# EAGLE design USB_3V3 (EAGLE 5.06)
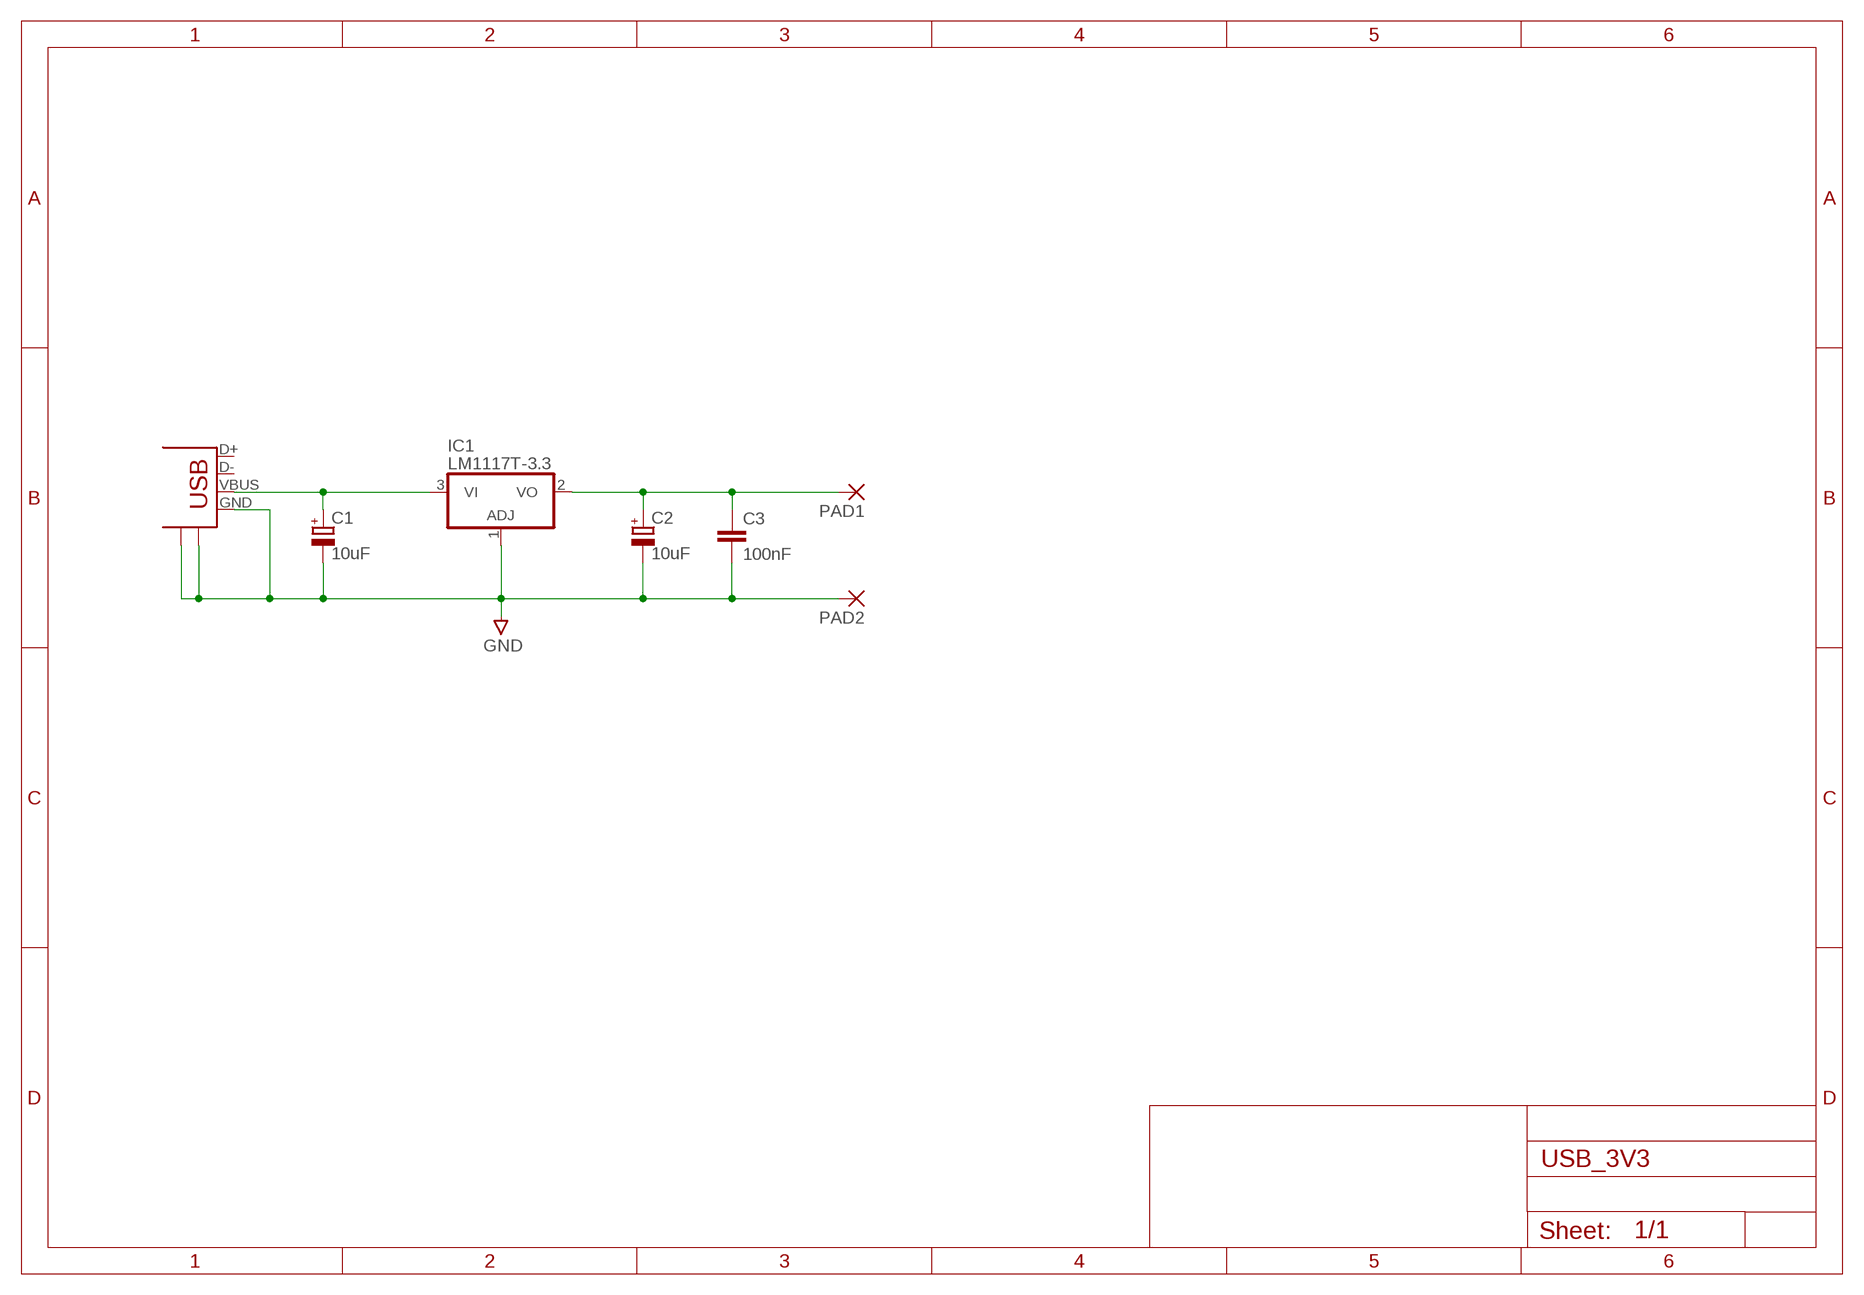
[diagram p0: schematic, sheet 1]

## Parts
C1  10uF  CPOL-EUE2.5-6  [E2,5-6]
C2  10uF  CPOL-EUE2.5-6  [E2,5-6]
C3  100nF  C-EU025-025X050  [C025-025X050]
IC1  LM1117T-3.3  317T  [TO220H]
PAD1  2,15/1,0  [2,15/1,0]
PAD2  2,15/1,0  [2,15/1,0]
USB1  USB-B-H  [USB-B-H]

## Nets
3V3OUT: C2.+ C3.1 IC1.2(VO) PAD1.1(P)
GND: C1.- C2.- C3.2 IC1.1(ADJ) PAD2.1(P) USB1.GND USB1.GND@1(GND) USB1.GND@2(GND)
VBUS: C1.+ IC1.3(VI) USB1.VBUS
Unconnected: USB1.D+ USB1.D-

## Library data of the parts
C1 C2 = rcl:CPOL-EU: POLARIZED CAPACITOR, European symbol
C3 = rcl:C-EU: CAPACITOR, European symbol
IC1 = linear:*317: Positive VOLTAGE REGULATOR
PAD1 PAD2 = wirepad:2,15/1,0: THROUGH-HOLE PAD
USB1 = IANS:USB: USB Connectors

## Board
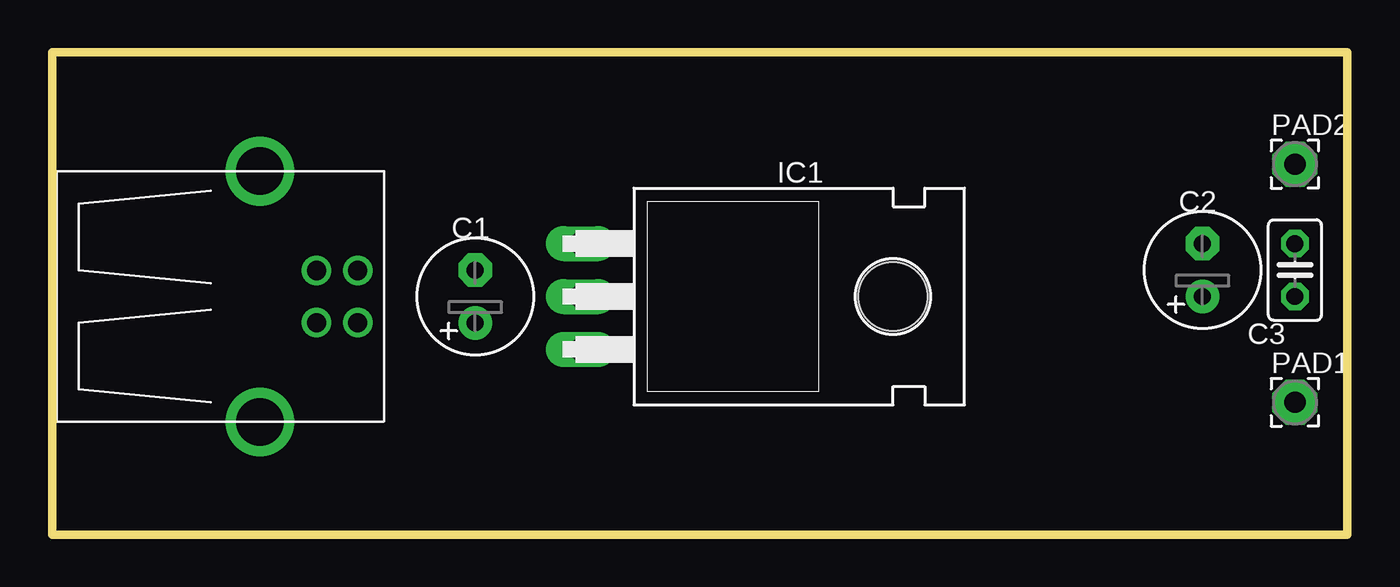
[diagram p1: board, top side]
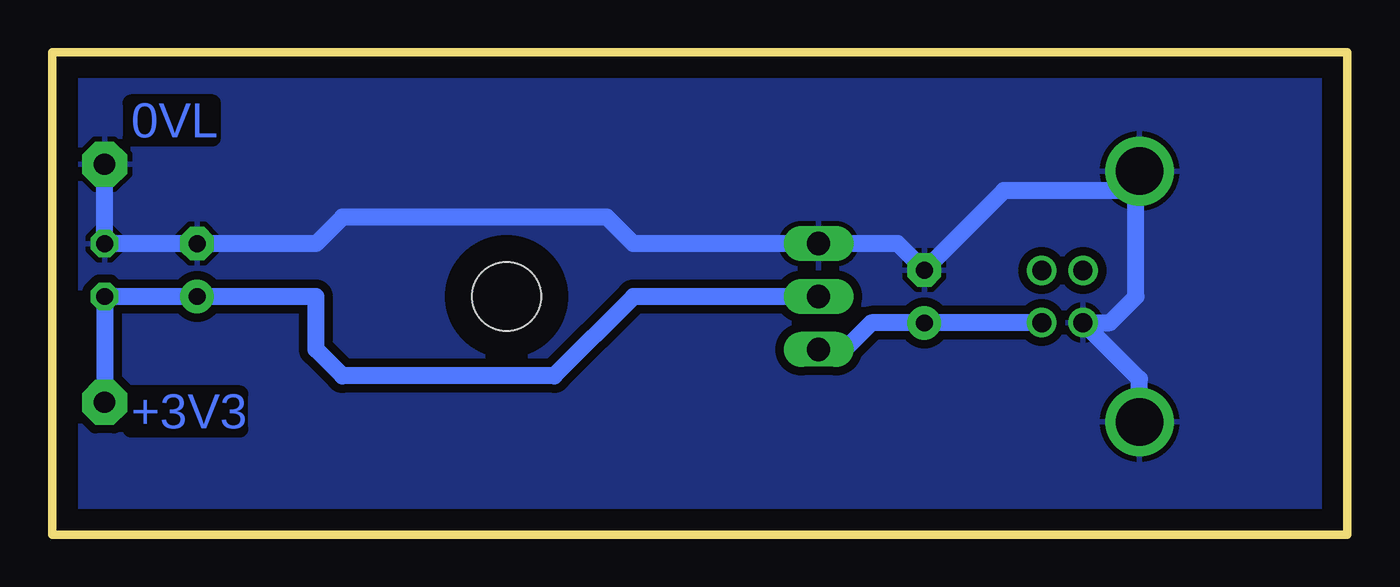
[diagram p2: board, bottom side, seen from below]

Size 62.21 x 23.16 mm. Coordinates in mm from the lower left corner, seen from the top.
Outline: 0,0 62.21,0 62.21,23.16 0,23.16 0,0
Copper layers (1*16): Top 0.035mm / dielectric 1.5mm / Bottom 0.035mm
Design rules "default": minimum track width 10mil, minimum drill 24mil, track to track 8mil, track to pad 8mil, pad to pad 8mil, via to via 8mil, smd to smd 8mil, copper to edge 40mil, drill to drill 8mil, minimum pad ring 10mil, minimum via ring 8mil, stop-mask expansion 4mil, vias tented up to drill 0mil, thermal gap 10mil

### Footprints (pad centres in the part's own frame; a part is rotated, then mirrored left to right if it is on the bottom)
E2,5-6 = drill 0.813 pad 1.6 round: + -1.27,0 | drill 0.813 pad 1.6 octagon: - 1.27,0
C025-025X050 = drill 0.813 octagon: 1 -1.27,0; 2 1.27,0
TO220H = drill 1.118 long: 1 -2.54,-10.16; 2 0,-10.16; 3 2.54,-10.16 | hole 3.302: 0,4.826
2,15/1,0 = drill 1.016 pad 2.159 octagon: 1 0,0
USB-B-H = drill 0.914 round: D+ 0,1.25; D- 1.981,1.25; GND 0,-1.25; VBUS 1.981,-1.25 | drill 2.286 round: GND@1 -2.718,6.02; GND@2 -2.718,-6.02

### Placement (x,y rotation side)
C1  20.32,11.43 90 top
C2  55.24,12.7 90 top
C3  59.69,12.7 90 top
IC1  35.56,11.43 270 top
PAD1  59.69,6.35 0 top
PAD2  59.69,17.78 0 top
USB1  12.7,11.43 0 top

### Tracks (layer width: path | path; a pad name or v marks a point on that pad's centre or on a via)
3V3OUT
  Bottom 0.813: IC1.2 34.29,11.43 38.1,7.62 48.26,7.62 49.53,8.89 49.53,11.43 C2.+ C3.1 PAD1.1
GND
  Bottom 0.813: USB1.GND@2 9.98,7.46 USB1.GND 11.41,10.18 10.16,11.43 10.16,17.27 USB1.GND@1 10.92,16.51 16.51,16.51 C1.- 21.59,13.97 IC1.1 34.29,13.97 35.56,15.24 48.26,15.24 49.53,13.97 C2.- C3.2 PAD2.1
  pour Bottom (isolate 0.406): 0.64,0 0.64,22.86 61.59,22.86 61.59,0
VBUS
  Bottom 0.813: USB1.VBUS 20.3,10.18 C1.+ 22.86,10.16 24.13,8.89 IC1.3

### Text on the board
Bottom: 0VL | +3V3